# Altium schematic sheet Display.SchDoc
size A4; SheetNumber: 8; SheetTotal: 12
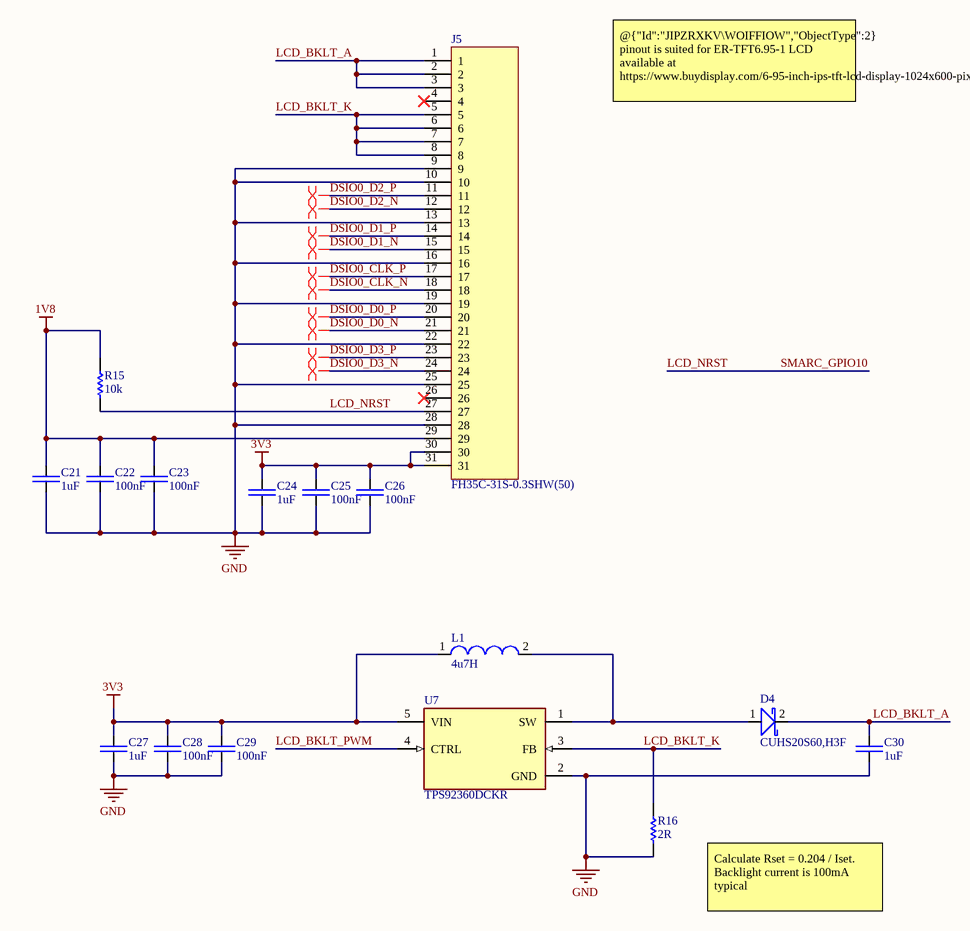
[diagram p0: Display.SchDoc]

## Parts
C21  1uF  [CAP-0805]
C22  100nF  [CAP-0603]
C23  100nF  [CAP-0603]
C24  1uF  [CAP-0805]
C25  100nF  [CAP-0603]
C26  100nF  [CAP-0603]
C27  1uF  [CAP-0805]
C28  100nF  [CAP-0603]
C29  100nF  [CAP-0603]
C30  1uF  [CAP-0805]
D4  CUHS20S60,H3F  [CUHS20S60,H3F]
J5  FH35C-31S-0.3SHW(50)  [HRS_FH35C-31S-0.3SHW(50)]
L1  4u7H  [IND-1210]
R15  10k  [RES-0603]
R16  2R  [RES-0603]
U7  TPS92360DCKR  [FP-DCK0005A-IPC_C]

## Nets
1V8: C21.2 C22.2 C23.2 J5.29 R15.2
3V3: C24.2 C25.2 C26.2 C27.2 C28.2 C29.2 J5.30 J5.31 L1.1 U7.5(VIN)
GND: C21.1 C22.1 C23.1 C24.1 C25.1 C26.1 C27.1 C28.1 C29.1 C30.1 J5.9 J5.10 J5.13 J5.16 J5.19 J5.22 J5.25 J5.28 R16.1 U7.2(GND)
DSIO0_CLK_N: J5.18
DSIO0_CLK_P: J5.17
DSIO0_D0_N: J5.21
DSIO0_D0_P: J5.20
DSIO0_D1_N: J5.15
DSIO0_D1_P: J5.14
DSIO0_D2_N: J5.12
DSIO0_D2_P: J5.11
DSIO0_D3_N: J5.24
DSIO0_D3_P: J5.23
LCD_BKLT_A: C30.2 D4.2 J5.1 J5.2 J5.3
LCD_BKLT_K: J5.5 J5.6 J5.7 J5.8 R16.2 U7.3(FB)
LCD_BKLT_PWM: U7.4(CTRL)
LCD_NRST: J5.27 R15.1  [also labelled SMARC_GPIO10]
NetD4_1: D4.1 L1.2 U7.1(SW)

Not connected (* = marked no-connect by the designer): J5 4* 26*

## Layout directives
differential pair: DSIO0_CLK_N, DSIO0_CLK_P, DSIO0_D0_N, DSIO0_D0_P, DSIO0_D1_N, DSIO0_D1_P, DSIO0_D2_N, DSIO0_D2_P, DSIO0_D3_N, DSIO0_D3_P

## Notes on the sheet
- @{"Id":"JIPZRXKV\WOIFFIOW","ObjectType":2} pinout is suited for ER-TFT6.95-1 LCD available at https://www.buydisplay.com/6-95-inch-ips-tft-lcd-display-1024x600-pixels-with-mipi-interface
- Calculate Rset = 0.204 / Iset. Backlight current is 100mA typical

## Library data of the parts
C21 C24 C27 C30 = CAP-0805: Capacitor chip unpolarized. 0805
C22 C23 C25 C26 C28 C29 = CAP-0603: Capacitor chip unpolarized. 0603
D4 = CUHS20S60,H3F: Diode Schottky 2A 0.5V
J5 = FH35C-31S-0.3SHW(50): 31 Position FPC Connector Contacts, Top and Bottom 0.012 (0.30mm) Surface Mount, Right Angle; MF: Hirose Electric; SnapEDA_Link: https://www.snapeda.com/parts/FH35C-31S-0.3SHW(50)/Hirose/view-part/?ref=snap; Package: None; Value: *; MP: FH35C-31S-0.3SHW(50); Check_prices: https://www.snapeda.com/parts/FH35C-31S-0.3SHW(50)/Hirose/view-part/?ref=eda
L1 = IND-1210
R15 R16 = RES-0603: Resistor chip. 0603
U7 = CMP-04914-000056-1: 38-V 1.2-A single channel LED backlight driver 5-SC70 -40 to 85